# Altium project Apogee Detection.PrjPCB (part 1 of 2)
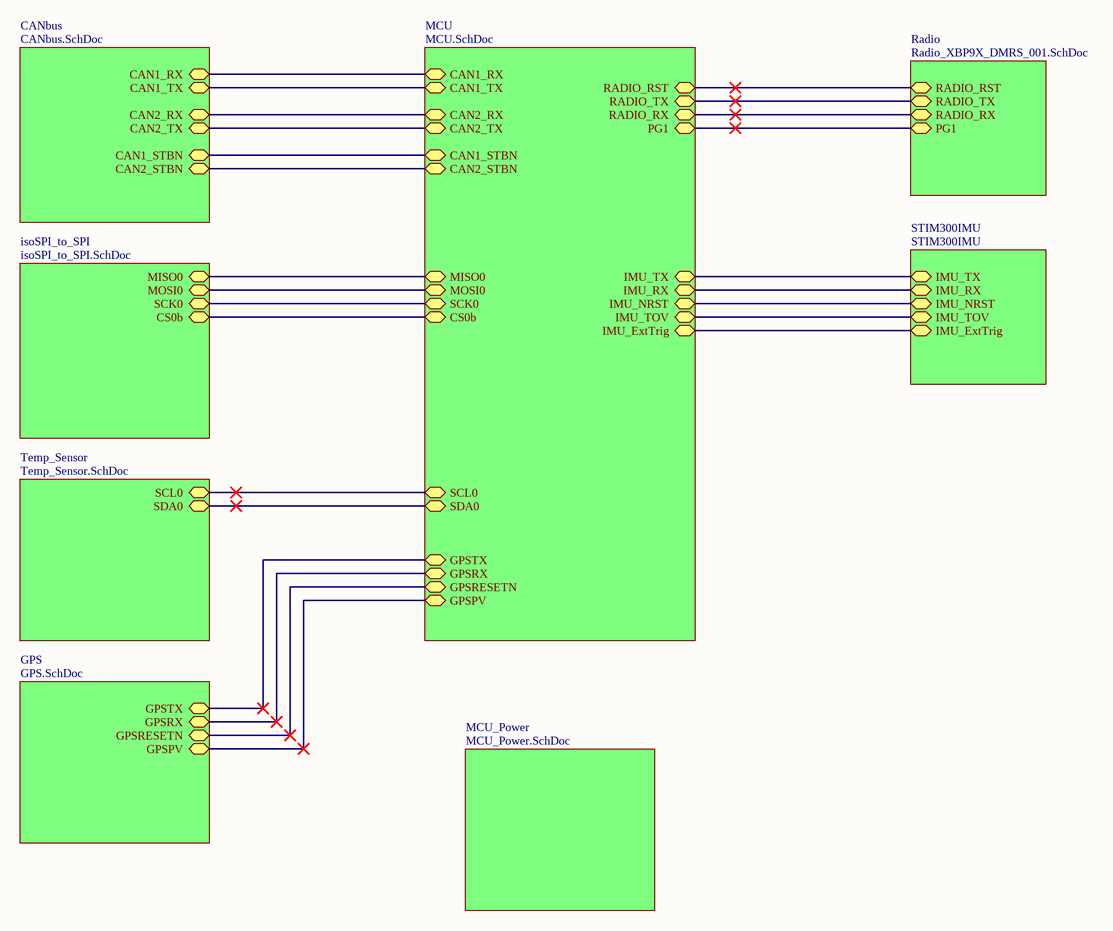
[diagram p0: Flight_Computer.SchDoc]
9 sheets, 125 parts. Net scope: hierarchical (ports join the sheet entries above them; power ports are global).
Board file: 4500-WB_AV_MainPCB.PcbDoc
Sheets:
  Flight_Computer.SchDoc
    MCU = MCU.SchDoc
    CANbus = CANbus.SchDoc
    isoSPI_to_SPI = isoSPI_to_SPI.SchDoc
    Temp_Sensor = Temp_Sensor.SchDoc
    Radio = Radio_XBP9X_DMRS_001.SchDoc
    STIM300IMU = STIM300IMU.SchDoc
    MCU_Power = MCU_Power.SchDoc
    GPS = GPS.SchDoc

## Sheet Flight_Computer.SchDoc
size Letter

### Sub-sheets
CANbus = CANbus.SchDoc: CAN1_RX (bidir), CAN1_TX (bidir), CAN2_RX (bidir), CAN2_TX (bidir), CAN1_STBN (bidir), CAN2_STBN (bidir)
GPS = GPS.SchDoc: GPSTX (bidir), GPSRX (bidir), GPSRESETN (bidir), GPSPV (bidir)
isoSPI_to_SPI = isoSPI_to_SPI.SchDoc: MISO0 (bidir), MOSI0 (bidir), SCK0 (bidir), CS0b (bidir)
MCU = MCU.SchDoc: CAN1_RX (bidir), CAN1_TX (bidir), CAN2_RX (bidir), CAN2_TX (bidir), MISO0 (bidir), MOSI0 (bidir), SCK0 (bidir), CS0b (bidir), SCL0 (bidir), SDA0 (bidir), CAN1_STBN (bidir), CAN2_STBN (bidir), RADIO_TX (bidir), RADIO_RX (bidir), IMU_TX (bidir), IMU_RX (bidir), IMU_NRST (bidir), IMU_TOV (bidir), IMU_ExtTrig (bidir), GPSTX (bidir), GPSRX (bidir), GPSRESETN (bidir), GPSPV (bidir), PG1 (bidir), RADIO_RST (bidir)
MCU_Power = MCU_Power.SchDoc: no entries
Radio = Radio_XBP9X_DMRS_001.SchDoc: RADIO_RX (bidir), RADIO_TX (bidir), PG1 (bidir), RADIO_RST (bidir)
STIM300IMU = STIM300IMU: IMU_TX (bidir), IMU_RX (bidir), IMU_NRST (bidir), IMU_TOV (bidir), IMU_ExtTrig (bidir)
Temp_Sensor = Temp_Sensor.SchDoc: SCL0 (bidir), SDA0 (bidir)

### Nets
CAN1_RX: sheet MCU/CAN1_RX, sheet CANbus/CAN1_RX
CAN1_STBN: sheet MCU/CAN1_STBN, sheet CANbus/CAN1_STBN
CAN1_TX: sheet MCU/CAN1_TX, sheet CANbus/CAN1_TX
CAN2_RX: sheet MCU/CAN2_RX, sheet CANbus/CAN2_RX
CAN2_STBN: sheet MCU/CAN2_STBN, sheet CANbus/CAN2_STBN
CAN2_TX: sheet MCU/CAN2_TX, sheet CANbus/CAN2_TX
CS0b: sheet MCU/CS0b, sheet isoSPI_to_SPI/CS0b
GPSPV: sheet MCU/GPSPV, sheet GPS/GPSPV
GPSRESETN: sheet MCU/GPSRESETN, sheet GPS/GPSRESETN
GPSRX: sheet MCU/GPSRX, sheet GPS/GPSRX
GPSTX: sheet MCU/GPSTX, sheet GPS/GPSTX
IMU_ExtTrig: sheet MCU/IMU_ExtTrig, sheet STIM300IMU/IMU_ExtTrig
IMU_NRST: sheet MCU/IMU_NRST, sheet STIM300IMU/IMU_NRST
IMU_RX: sheet MCU/IMU_RX, sheet STIM300IMU/IMU_RX
IMU_TOV: sheet MCU/IMU_TOV, sheet STIM300IMU/IMU_TOV
IMU_TX: sheet MCU/IMU_TX, sheet STIM300IMU/IMU_TX
MISO0: sheet MCU/MISO0, sheet isoSPI_to_SPI/MISO0
MOSI0: sheet MCU/MOSI0, sheet isoSPI_to_SPI/MOSI0
PG1: sheet MCU/PG1, sheet Radio/PG1
RADIO_RST: sheet MCU/RADIO_RST, sheet Radio/RADIO_RST
RADIO_RX: sheet MCU/RADIO_RX, sheet Radio/RADIO_RX
RADIO_TX: sheet MCU/RADIO_TX, sheet Radio/RADIO_TX
SCK0: sheet MCU/SCK0, sheet isoSPI_to_SPI/SCK0
SCL0: sheet MCU/SCL0, sheet Temp_Sensor/SCL0
SDA0: sheet MCU/SDA0, sheet Temp_Sensor/SDA0

## Sheet MCU.SchDoc
size A3
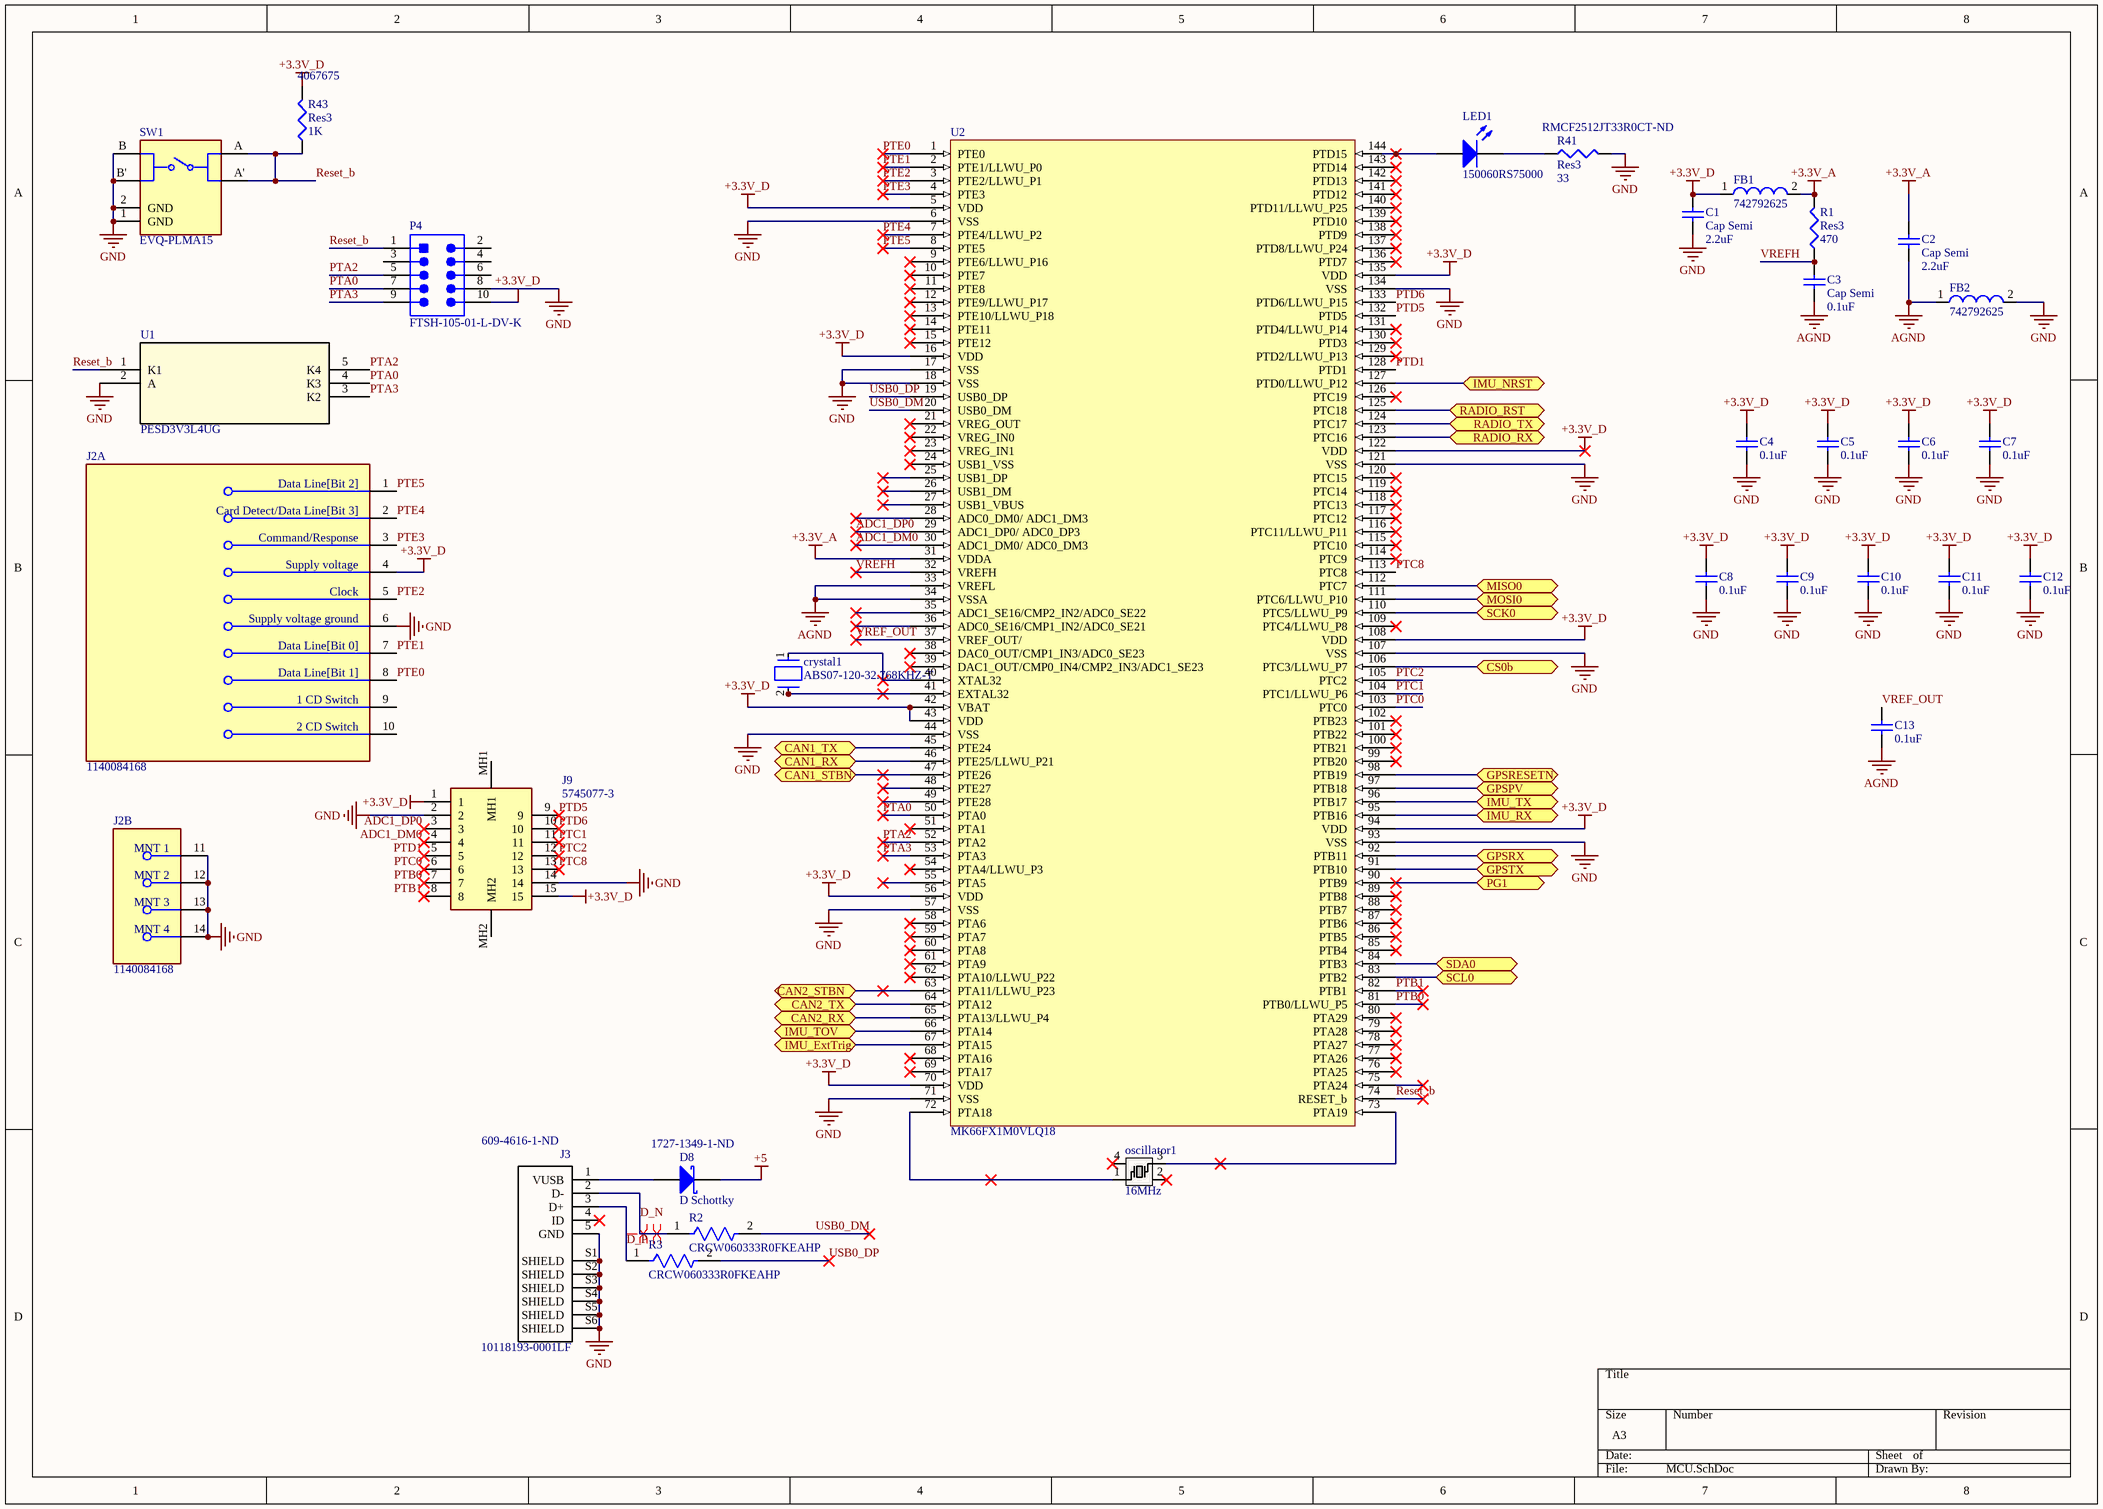
[diagram p1: MCU.SchDoc]

### Parts
C1  Cap Semi  value 2.2uF  [C1206]
C2  Cap Semi  value 2.2uF  [C1206]
C3  Cap Semi  value 0.1uF  [C1206]
C4  0.1uF  [J1-0603]
C5  0.1uF  [J1-0603]
C6  0.1uF  [J1-0603]
C7  0.1uF  [J1-0603]
C8  0.1uF  [J1-0603]
C9  0.1uF  [J1-0603]
C10  0.1uF  [J1-0603]
C11  0.1uF  [J1-0603]
C12  0.1uF  [J1-0603]
C13  0.1uF  [J1-0603]
crystal1  ABS07-120-32.768KHZ-T  [FP-ABS07-120-MFG]
D8  D Schottky  Supplier Part Number 1: 1727-1349-1-ND  [DIO_PMEG6030EVPX]
FB1  742792625  [SMD-0603]
FB2  742792625  [SMD-0603]
J2  1140084168  [FP-1140084168-0]  (parts A,B of 2)
J3  10118193-0001LF  Supplier Part Number 1: 609-4616-1-ND  [FCI_10118193-0001LF_10118193-0001LF(Primary)]
J9  5745077-3  [2301840-1]
LED1  150060RS75000  [0603_A]
oscillator1  value 16MHz  [ECS-160-8-30B-CKM]  (hidden comment: SMD_oscillator)
P4  FTSH-105-01-L-DV-K  [SMTC-FTSH-105-01-L-DV-K_V]
R1  Res3  value 470  [J1-0603]
R2  CRCW060333R0FKEAHP  [FP-CRCW0603-HPe3-IPC_B]
R3  CRCW060333R0FKEAHP  [FP-CRCW0603-HPe3-IPC_B]
R41  Res3  value 33  Supplier Part Number 2: RMCF2512JT33R0CT-ND  [J1-0603]
R43  Res3  value 1K  Supplier Part Number 1: 4067675  [J1-0603]
SW1  EVQ-PLMA15  [FP-EVQ-PLMA15-MFG]
U1  PESD3V3L4UG  [SOT353_NXP]
U2  MK66FX1M0VLQ18  [98ASS23177W]

### Ports
CAN1_RX (bidir), CAN1_STBN (bidir), CAN1_TX (bidir), CAN2_RX (bidir), CAN2_STBN (bidir), CAN2_TX (bidir), CS0b (bidir), GPSPV (bidir), GPSRESETN (bidir), GPSRX (bidir), GPSTX (bidir), IMU_ExtTrig (bidir), IMU_NRST (bidir), IMU_RX (bidir), IMU_TOV (bidir), IMU_TX (bidir), MISO0 (bidir), MOSI0 (bidir), PG1 (bidir), RADIO_RST (bidir), RADIO_RX (bidir), RADIO_TX (bidir), SCK0 (bidir), SCL0 (bidir), SDA0 (bidir)

### Nets
+3.3V_A: C2.2 FB1.2 R1.2 U2.31(VDDA)
+3.3V_D: C1.2 C4.2 C5.2 C6.2 C7.2 C8.2 C9.2 C10.2 C11.2 C12.2 FB1.1 J2.4(Supply_voltage) J9.1 J9.15 P4.10 R43.2 U2.5(VDD) U2.16(VDD) U2.42(VBAT) U2.43(VDD) U2.56(VDD) U2.70(VDD) U2.94(VDD) U2.108(VDD) U2.122(VDD) U2.135(VDD)
+5: D8.2(K)
AGND: C2.1 C3.1 C13.1 FB2.1 U2.33(VREFL) U2.34(VSSA)
GND: C1.1 C4.1 C5.1 C6.1 C7.1 C8.1 C9.1 C10.1 C11.1 C12.1 FB2.2 J2.6(Supply_voltage_ground) J2.11(MNT_1) J2.12(MNT_2) J2.13(MNT_3) J2.14(MNT_4) J3.5(GND) J3.S1(SHIELD) J3.S2(SHIELD) J3.S3(SHIELD) J3.S4(SHIELD) J3.S5(SHIELD) J3.S6(SHIELD) J9.2 J9.14 P4.8 R41.2 SW1.1(GND) SW1.2(GND) SW1.B SW1.B' U1.2(A) U2.6(VSS) U2.17(VSS) U2.18(VSS) U2.44(VSS) U2.57(VSS) U2.71(VSS) U2.93(VSS) U2.107(VSS) U2.121(VSS) U2.134(VSS)
ADC1_DM0: J9.4 U2.30(ADC1_DM0/_ADC0_DM3)
ADC1_DP0: J9.3 U2.29(ADC1_DP0/_ADC0_DP3)
CAN1_RX: U2.46(PTE25/LLWU_P21) ; port CAN1_RX
CAN1_STBN: U2.47(PTE26) ; port CAN1_STBN
CAN1_TX: U2.45(PTE24) ; port CAN1_TX
CAN2_RX: U2.65(PTA13/LLWU_P4) ; port CAN2_RX
CAN2_STBN: U2.63(PTA11/LLWU_P23) ; port CAN2_STBN
CAN2_TX: U2.64(PTA12) ; port CAN2_TX
CS0b: U2.106(PTC3/LLWU_P7) ; port CS0b
D_N: J3.2(D-) R2.1
D_P: J3.3(D+) R3.1
GPSPV: U2.97(PTB18) ; port GPSPV
GPSRESETN: U2.98(PTB19) ; port GPSRESETN
GPSRX: U2.92(PTB11) ; port GPSRX
GPSTX: U2.91(PTB10) ; port GPSTX
IMU_ExtTrig: U2.67(PTA15) ; port IMU_ExtTrig
IMU_NRST: U2.127(PTD0/LLWU_P12) ; port IMU_NRST
IMU_RX: U2.95(PTB16) ; port IMU_RX
IMU_TOV: U2.66(PTA14) ; port IMU_TOV
IMU_TX: U2.96(PTB17) ; port IMU_TX
MISO0: U2.112(PTC7) ; port MISO0
MOSI0: U2.111(PTC6/LLWU_P10) ; port MOSI0
PG1: U2.90(PTB9) ; port PG1
PTA0: P4.7 U1.4(K3) U2.50(PTA0)
PTA2: P4.5 U1.5(K4) U2.52(PTA2)
PTA3: P4.9 U1.3(K2) U2.53(PTA3)
PTB0: J9.7 U2.81(PTB0/LLWU_P5)
PTB1: J9.8 U2.82(PTB1)
PTC0: J9.6 U2.103(PTC0)
PTC1: J9.11 U2.104(PTC1/LLWU_P6)
PTC2: J9.12 U2.105(PTC2)
PTC8: J9.13 U2.113(PTC8)
PTD1: J9.5 U2.128(PTD1)
PTD5: J9.9 U2.132(PTD5)
PTD6: J9.10 U2.133(PTD6/LLWU_P15)
PTE0: J2.8(Data_Line[Bit_1]) U2.1(PTE0)
PTE1: J2.7(Data_Line[Bit_0]) U2.2(PTE1/LLWU_P0)
PTE2: J2.5(Clock) U2.3(PTE2/LLWU_P1)
PTE3: J2.3(Command/Response) U2.4(PTE3)
PTE4: J2.2(Card_Detect/Data_Line[Bit_3]) U2.7(PTE4/LLWU_P2)
PTE5: J2.1(Data_Line[Bit_2]) U2.8(PTE5)
RADIO_RST: U2.125(PTC18) ; port RADIO_RST
RADIO_RX: U2.123(PTC16) ; port RADIO_RX
RADIO_TX: U2.124(PTC17) ; port RADIO_TX
Reset_b: P4.1 R43.1 SW1.A SW1.A' U1.1(K1) U2.74(RESET_b)
SCK0: U2.110(PTC5/LLWU_P9) ; port SCK0
SCL0: U2.83(PTB2) ; port SCL0
SDA0: U2.84(PTB3) ; port SDA0
USB0_DM: R2.2 U2.20(USB0_DM)
USB0_DP: R3.2 U2.19(USB0_DP)
VREF_OUT: C13.2 U2.37(VREF_OUT/)
VREFH: C3.2 R1.1 U2.32(VREFH)
Netcrystal1_1: crystal1.1 U2.40(XTAL32)
Netcrystal1_2: crystal1.2 U2.41(EXTAL32)
NetD8_1: D8.1(A) J3.1(VUSB)
NetLED1_1: LED1.1(K) R41.1
NetLED1_2: LED1.2(A) U2.144(PTD15)
Netoscillator1_1: oscillator1.1 U2.72(PTA18)
Netoscillator1_3: oscillator1.3 U2.73(PTA19)

Not connected (* = marked no-connect by the designer): J2 9(1_CD_Switch) 10(2_CD_Switch); J3 4(ID)*; J9 MH1 MH2; oscillator1 2* 4*; P4 2 3 4 6; U2 9(PTE6/LLWU_P16)* 10(PTE7)* 11(PTE8)* 12(PTE9/LLWU_P17)* 13(PTE10/LLWU_P18)* 14(PTE11)* 15(PTE12)* 21(VREG_OUT)* 22(VREG_IN0)* 23(VREG_IN1)* 24(USB1_VSS)* 25(USB1_DP)* 26(USB1_DM)* 27(USB1_VBUS)* 28(ADC0_DM0/_ADC1_DM3)* 35(ADC1_SE16/CMP2_IN2/ADC0_SE22)* 36(ADC0_SE16/CMP1_IN2/ADC0_SE21)* 38(DAC0_OUT/CMP1_IN3/ADC0_SE23)* 39(DAC1_OUT/CMP0_IN4/CMP2_IN3/ADC1_SE23)* 48(PTE27)* 49(PTE28)* 51(PTA1)* 54(PTA4/LLWU_P3)* 55(PTA5)* 58(PTA6)* 59(PTA7)* 60(PTA8)* 61(PTA9)* 62(PTA10/LLWU_P22)* 68(PTA16)* 69(PTA17)* 75(PTA24)* 76(PTA25)* 77(PTA26)* 78(PTA27)* 79(PTA28)* 80(PTA29)* 85(PTB4)* 86(PTB5)* 87(PTB6)* 88(PTB7)* 89(PTB8)* 99(PTB20)* 100(PTB21)* 101(PTB22)* 102(PTB23)* 109(PTC4/LLWU_P8)* 114(PTC9)* 115(PTC10)* 116(PTC11/LLWU_P11)* 117(PTC12)* 118(PTC13)* 119(PTC14)* 120(PTC15)* 126(PTC19)* 129(PTD2/LLWU_P13)* 130(PTD3)* 131(PTD4/LLWU_P14)* 136(PTD7)* 137(PTD8/LLWU_P24)* 138(PTD9)* 139(PTD10)* 140(PTD11/LLWU_P25)* 141(PTD12)* 142(PTD13)* 143(PTD14)*

### Layout directives
differential pair: D_N, D_P

### Library data of the parts
C1 C2 = Cap Semi: Capacitor (Semiconductor SIM Model); SPN: 311-3513-1-ND; Published: 8-Jun-2000; LatestRevisionDate: 29-May-2009; LatestRevisionNote: IPC-7351 Footprint Added.; PackageReference: C1206; Publisher: Altium Limited; PackageDescription: Chip Capacitor
C3 = Cap Semi: Capacitor (Semiconductor SIM Model); SPN: 1276-1017-1-ND; Published: 8-Jun-2000; LatestRevisionDate: 29-May-2009; LatestRevisionNote: IPC-7351 Footprint Added.; PackageReference: C1206; Publisher: Altium Limited; PackageDescription: Chip Capacitor
C4-C13 = CAP-0402: CAP CER 0.1UF 25V X7R 0603; Manufacturer: Kyocera AVX; Manufacturer Part Number: 06033C104JAT2A; Dielectric Material: Ceramic; Capacitance: 100nF; Tolerance: 5%; Supplier 1: Digi-Key; Supplier Part Number 1: 478-3713-1-ND; RoHS: Yes; Category: Ceramic Capacitors; Stock 1: 348868; Pricing 1: 1=0.33000, 10=0.23100, 50=0.16180, 100=0.13870, 500=0.10400, 1000=0.08782 (USD); Mount: Surface Mount,PCB,Through Hole; Case/Package: 0603; Number of Pins: 2; Case Code (Metric): 1608; Case Code (Imperial): 0603; Contact Plating: Tin,Matte; Min Operating Temperature: -55°C; Max Operating Temperature: 125°C; Voltage Rating: 25V; Packaging: Tape and Reel; Package Quantity: 1; Dielectric: X7R; Termination: SMD/SMT; Voltage Rating (DC): 25V; Voltage: 25V; Length: 1.6mm; Height: 0.9mm; Width: 0.032inch; Thickness: 0.035inch; Depth: 0.81mm; Lead Pitch: 5.08mm; Radiation Hardening: No; REACH SVHC: No SVHC; Lead Free: Lead Free; ComponentLink1URL: https://datasheet.ciiva.com/208/cx7r-208464.pdf?src-supplier=Digi-Key; ComponentLink1Description: https://datasheet.ciiva.com/208/cx7r-208464.pdf?src-supplier=Digi-Key; ComponentLink2URL: https://datasheet.ciiva.com/208/cx7r-208465.pdf?src-supplier=Digi-Key; ComponentLink2Description: https://datasheet.ciiva.com/208/cx7r-208465.pdf?src-supplier=Digi-Key; ComponentLink3URL: https://datasheet.ciiva.com/1124/1679506-1124547.pdf?src-supplier=Element14; ComponentLink3Description: https://datasheet.ciiva.com/1124/1679506-1124547.pdf?src-supplier=Element14; ComponentLink4URL: https://datasheet.ciiva.com/1124/1679506-1124548.pdf?src-supplier=Element14; ComponentLink4Description: https://datasheet.ciiva.com/1124/1679506-1124548.pdf?src-supplier=Element14; ComponentLink5URL: https://datasheet.ciiva.com/5423/cx7r-218113-5423653.pdf?src-supplier=Mouser; ComponentLink5Description: https://datasheet.ciiva.com/5423/cx7r-218113-5423653.pdf?src-supplier=Mouser; ComponentLink6URL: https://datasheet.ciiva.com/7855/1679506-7855045.pdf?src-supplier=Element14; ComponentLink6Description: https://datasheet.ciiva.com/7855/1679506-7855045.pdf?src-supplier=Element14; ComponentLink7URL: https://datasheet.ciiva.com/15165/getdatasheetpartid-33578-15165094.pdf?src-supplier=Verical; ComponentLink7Description: https://datasheet.ciiva.com/15165/getdatasheetpartid-33578-15165094.pdf?src-supplier=Verical; ComponentLink8URL: https://datasheet.ciiva.com/2987/cx7r-2987753.pdf?src-supplier=Avnet; ComponentLink8Description: https://datasheet.ciiva.com/2987/cx7r-2987753.pdf?src-supplier=Avnet; ComponentLink9URL: https://datasheet.ciiva.com/14595/70001075-14595082.pdf?src-supplier=Allied+Electronics; ComponentLink9Description: https://datasheet.ciiva.com/14595/70001075-14595082.pdf?src-supplier=Allied+Electronics; ComponentLink10URL: https://datasheet.ciiva.com/14590/70001075-14590332.pdf?src-supplier=Allied+Electronics; ComponentLink10Description: https://datasheet.ciiva.com/14590/70001075-14590332.pdf?src-supplier=Allied+Electronics; ComponentLink11URL: https://datasheet.ciiva.com/208/cx7r-208463.pdf?src-supplier=Digi-Key; ComponentLink11Description: https://datasheet.ciiva.com/208/cx7r-208463.pdf?src-supplier=Digi-Key
crystal1 = CMP-2000-07587-2: CRYSTAL 32.7680KHZ 6PF SMD; Frequency Tolerance: 20ppm; Series Resistance: 60kR; ESR (Equivalent Series Resistance): 55kR; Depth: 1.5mm; Width: 0.061inch; Number of Pins: 2; Max Operating Temperature: 85°C; Length: 3.2mm; Case/Package: SMD/SMT; Series: ABS07; Lead Free: Lead Free; Min Operating Temperature: -40°C; Load Capacitance: 6pF; Packaging: Tape and Reel; Height: 0.035inch; Radiation Hardening: No; Tolerance: 20ppm; Operating Frequency: 32.768 kHz; Termination: SMD/SMT; REACH SVHC: No SVHC; RoHS Compliant: Yes; Frequency: 32.768kHz; Package Quantity: 3000; Mount: Surface Mount
D8 = D Schottky: Rectifier Diode, Single, 60 V, 3 A, 475 Mv, 70 A, 175 C Rohs Compliant: Yes; Manufacturer: Nexperia USA; Manufacturer Part Number: PMEG6030EVPX; Average Rectified Current: 3A; Reverse Recovery Time: 20ns; Max Reverse Voltage (DC): 60V; Published: 8-Jun-2000; LatestRevisionDate: 17-Jul-2002; LatestRevisionNote: Re-released for DXP Platform.; PackageReference: SMB; Publisher: Altium Limited; PackageDescription: DO-214-AA/SMB; 2 C-Bend Leads; Body 5.3 x 3.6 mm, inc. leads (LxW); Code_JEDEC: DO-214-AA; Supplier 1: Digi-Key; RoHS: No; Category: Rectifier Diodes; Stock 1: 480077; Pricing 1: 1=0.47000, 10=0.38100, 100=0.21860, 500=0.20242, 1000=0.13765 (USD); Mount: Surface Mount; Packaging: Cut Tape; ComponentLink1URL: https://assets.nexperia.com/documents/data-sheet/PMEG6030EVP.pdf?src-supplier=Digi-Key; ComponentLink1Description: https://assets.nexperia.com/documents/data-sheet/PMEG6030EVP.pdf?src-supplier=Digi-Key
FB1 FB2 = CMP-0220-00174-1: SMD EMI Suppression Ferrite Bead WE-CBF, Z = 120 Ohm; Impedance: 120 Ohm; ComponentLink1Description: Manufacturer Link; ComponentLink1URL: http://www.we-online.com; DatasheetVersion: ver 1, Aug-2009; ComponentLink2URL: http://www.we-online.de/katalog/media/pdf/742792625.pdf; PackageDescription: Chip Inductor, 2-Leads, Body 1.6 x 0.8 mm; PackageReference: SMD-0603; ComponentLink2Description: Datasheet; PackageVersion: 2009
J2 = CMP-02360-000003-1: CONN MICRO SD CARD PUSH-PULL R/A; Gender: Receptacle; Number of Contacts: 8; Connector Type: Connector; Pitch: 1.1mm; Lead Free: Lead Free; Housing Material: Polymer; Radiation Hardening: No; Mount: Surface Mount; Depth: 11.45mm; Number of Rows: 1; Height: 1.55mm; Contact Plating: Gold; Package Quantity: 7500; Packaging: Tape and Reel; Termination: SMD/SMT; Length: 15.6mm; Orientation: Right Angle; Flammability Rating: UL94 V-0; Contact Material: Copper Alloy
J3 = 10118193-0001LF: CONN USB MICRO B RECPT SMT R/A; MF: Amphenol FCI; Gender: Female; Connector Type: USB,Receptacle; Number of Contacts: 5; Number of Ports: 1; Current Rating: 1.8A; Insulation Resistance: 1GR; Max Voltage Rating (AC): 100V; Pitch: 0.65mm; SnapEDA_Link: https://www.snapeda.com/parts/10118193-0001LF/Amphenol%20FCI/view-part/?ref=snap; Digi-Key_Purchase_URL: https://www.digikey.ca/product-detail/en/amphenol-fci/10118193-0001LF/609-4616-1-ND/2785380?utm_source=snapeda&utm_medium=aggregator&utm_campaign=symbol; Package: None; MP: 10118193-0001LF; Digi-Key_Part_Number: 609-4616-1-ND; Value: *; Supplier 1: Digi-Key; Manufacturer: Amphenol FCI; Manufacturer Part Number: 10118193-0001LF; RoHS: Yes; Category: USB Connectors; Stock 1: 48313; Pricing 1: 1=0.45000, 10=0.43000, 25=0.36840, 50=0.31320, 100=0.30090, 250=0.27016, 500=0.25788 (USD); Mount: Surface Mount,Horizontal; Contact Plating: Gold; Contact Material: Copper Alloy; Color: Black; Number of Terminals: 5; Housing Material: Polymer; Min Operating Temperature: -55°C; Max Operating Temperature: 85°C; Termination: Solder; Packaging: Tape and Reel; Orientation: Right Angle; Package Quantity: 1200; Voltage Rating: 100V; Features: Shielded; Length: 7.86mm; Depth: 5.67mm; Radiation Hardening: No; Flammability Rating: UL94 V-0; ComponentLink1URL: https://datasheet.ciiva.com/851/10118193-851106.pdf?src-supplier=Digi-Key; ComponentLink1Description: https://datasheet.ciiva.com/851/10118193-851106.pdf?src-supplier=Digi-Key; ComponentLink2URL: https://datasheet.ciiva.com/4598/10118193ac-197151-4598799.pdf?src-supplier=Mouser; ComponentLink2Description: https://datasheet.ciiva.com/4598/10118193ac-197151-4598799.pdf?src-supplier=Mouser; ComponentLink3URL: https://datasheet.ciiva.com/26853/getdatasheetpartid-418618-26853893.pdf?src-supplier=Verical; ComponentLink3Description: https://datasheet.ciiva.com/26853/getdatasheetpartid-418618-26853893.pdf?src-supplier=Verical; ComponentLink4URL: https://datasheet.ciiva.com/14802/10118193-0001lf-webpage-14802386.pdf?src-supplier=Arrow+Electronics; ComponentLink4Description: https://datasheet.ciiva.com/14802/10118193-0001lf-webpage-14802386.pdf?src-supplier=Arrow+Electronics; ComponentLink5URL: https://datasheet.ciiva.com/851/10118193-851108.pdf?src-supplier=Digi-Key; ComponentLink5Description: https://datasheet.ciiva.com/851/10118193-851108.pdf?src-supplier=Digi-Key; ComponentLink6URL: https://datasheet.ciiva.com/851/10118193-851107.pdf?src-supplier=Digi-Key; ComponentLink6Description: https://datasheet.ciiva.com/851/10118193-851107.pdf?src-supplier=Digi-Key; ComponentLink7URL: https://datasheet.ciiva.com/14618/70236827-14618887.pdf?src-supplier=Allied+Electronics; ComponentLink7Description: https://datasheet.ciiva.com/14618/70236827-14618887.pdf?src-supplier=Allied+Electronics
J9 = 5745077-3: Connector; Manufacturer_Name: TE Connectivity; Datasheet Link: https://www.te.com/commerce/DocumentDelivery/DDEController?Action=srchrtrv&DocNm=5745077&DocType=Customer+Drawing&DocLang=English; Height: 12.55mm; Manufacturer_Part_Number: 5745077-3
LED1 = CMP-1426-00001-1: SMD mono-color Chip LED, WL-SMCW, Red; Manufacturer: Wuerth Elektronik; Color: Red; PackageReference: 0603_A; ComponentLink2URL: http://katalog.we-online.com/led/datasheet/150060RS75000.pdf; ComponentLink1URL: http://www.we-online.com; ComponentLink1Description: Manufacturer URL; ComponentLink2Description: Datasheet; PartNumber: 150060RS75000
oscillator1 = ECS-160-8-30B-CKM: SPN: XC1839CT-ND
P4 = CMP-2000-05353-1: Male Header, Pitch 1.27 mm, 2 x 5 Position, Height 6.25 mm; Manufacturer: Samtec; Pitch: 0.050"(1.27mm); Other Names: Q3937619; Number of Positions: 10; Mating Products: SFMC-105-L2-S-D-TR-ND / -CONN.05"SURFACE10POSSMT / FLE-105-01-G-DV-TR-ND / -CONNSKT1.27MM10POSDUALSMD / FLE-105-01-G-DV-A-P-ND / -CONNSKT1.27MM10POSDUALSMD / FLE-105-01-G-DV-A-ND / -CONNSKT1.27MM10POSDUALSMD / CLP-105-02-G-D-P-TR-ND / -CONNRCPT10POSDUAL.05"SMD / SAM1155-05-ND / -CONNRCPT10POSDUAL.05"SMD / SAM1154-05-ND / -CONNRCPT10POSDUAL.05"SMD / SAM1153-05-ND / -CONNRCPT10POSDUAL.05"SMD / SAM1226-05-ND / -CONNRCPT.05"10POSDUALSMD; Number of Positions Loaded: All; Connector Type: Header,Unshrouded; Product Training Modules: Board-to-BoardConnectors; Datasheet Version: Rev. ET, 10/1995; Number of Rows: 2; Standard Package: 1; Package Description: Male Header, Pitch 1.27 mm, 2 x 5 Position, Height 5.97 mm, Tail Length 4.32 mm; Contact Finish Thickness: 10µin(0.25µm); Series: FTSH; Termination: Solder; Contact Type: MalePin; Color: Black; Package Reference: FTSH-105-01-L-DV-K; Family: RectangularConnectors-Headers,MalePins; Package URL: http://suddendocs.samtec.com/prints/ftsh-1xx-xx-xxx-dv-xxx-footprint.pdf; Packaging: Tube; Mounting Type: SurfaceMount; Category: Connectors,Interconnects; Datasheet URL: http://suddendocs.samtec.com/prints/ftsh-1xx-xx-xxx-dv-xxx-mkt.pdf; Row Spacing: 0.050"(1.27mm); Manufacturer URL: http://www.samtec.com/; Contact Mating Length: 0.120"(3.05mm); Contact Finish: Gold
R1 = Res3: Resistor; SPN: RHM470ADCT-ND; Published: 8-Jun-2000; LatestRevisionDate: 29-May-2009; LatestRevisionNote: IPC-7351 Footprint Added.; PackageReference: J1-0603; Publisher: Altium Limited; PackageDescription: Chip Resistor
R2 R3 = CMP-02407-002371-1: RES Thick Film, 33Ω, 1%, 0.33W, 100ppm/°C, 0603; Power Rating: 250mW; Voltage Rating: 75V; Resistance: 33R; Max Operating Temperature: 155°C; Tolerance: 1%; Depth: 0.85mm; Radiation Hardening: No; Contact Plating: Tin; Length: 1.6mm; Features: Automotive AEC-Q200; Case/Package: 0603; Lead Free: Lead Free; Width: 0.033inch; Voltage Rating (DC): 75V; Mount: Surface Mount; Termination: SMD/SMT; Packaging: Tape and Reel; Package Quantity: 10; Composition: Thick Film; Min Operating Temperature: -55°C; Case Code (Metric): 1608; Height: 0.45mm; Military Standard: Not; Max Power Dissipation: 250mW; Number of Terminations: 2; Weight: 7.1E-05oz; Temperature Coefficient: 100ppm/°C; Case Code (Imperial): 0603
R41 = Res3: RES SMD 33 OHM 5% 1W 2512; Manufacturer: Vishay; Manufacturer Part Number: CRCW060333R0FKEA; SPN: 541-2782-1-ND; Resistance: 33R; Tolerance: 1%; Temperature Coefficient: 100ppm/°C; Power Rating: 100mW; Voltage Rating: 75V; Published: 8-Jun-2000; LatestRevisionDate: 29-May-2009; LatestRevisionNote: IPC-7351 Footprint Added.; PackageReference: J1-0603; Publisher: Altium Limited; PackageDescription: Chip Resistor; Supplier 1: Digi-Key; Supplier Part Number 1: 541-33.0HCT-ND; RoHS: Yes; Category: Chip SMD Resistors; Stock 1: 59910; Pricing 1: 1=0.10000, 10=0.03300, 100=0.01340, 1000=0.00602, 2500=0.00522 (USD); Mount: Surface Mount; Case/Package: 0603; Weight: 7.1E-05oz; Case Code (Imperial): 0603; Case Code (Metric): 1608; Contact Plating: Tin; Min Operating Temperature: -55°C; Max Operating Temperature: 155°C; Composition: Thick Film; Packaging: Tape and Reel; Number of Terminations: 2; Max Power Dissipation: 100mW; Voltage Rating (DC): 75V; Package Quantity: 10; Military Standard: Not; Termination: SMD/SMT; Features: Automotive AEC-Q200; Length: 1.55mm; Height: 0.45mm; Width: 0.85mm; Depth: 0.85mm; Radiation Hardening: No; Lead Free: Lead Free; REACH SVHC: Unknown; ComponentLink1URL: https://datasheet.ciiva.com/11809/0900766b80d98afc-11809158.pdf?src-supplier=RSComponents; ComponentLink1Description: https://datasheet.ciiva.com/11809/0900766b80d98afc-11809158.pdf?src-supplier=RSComponents; ComponentLink2URL: https://datasheet.ciiva.com/7777/1697337-7777317.pdf?src-supplier=Element14; ComponentLink2Description: https://datasheet.ciiva.com/7777/1697337-7777317.pdf?src-supplier=Element14; ComponentLink3URL: https://datasheet.ciiva.com/7777/1720486-7777557.pdf?src-supplier=Element14; ComponentLink3Description: https://datasheet.ciiva.com/7777/1720486-7777557.pdf?src-supplier=Element14; ComponentLink4URL: https://datasheet.ciiva.com/16783/70201119-16783349.pdf?src-supplier=Allied+Electronics; ComponentLink4Description: https://datasheet.ciiva.com/16783/70201119-16783349.pdf?src-supplier=Allied+Electronics; ComponentLink5URL: https://datasheet.ciiva.com/7777/1720486-7777558.pdf?src-supplier=Element14; ComponentLink5Description: https://datasheet.ciiva.com/7777/1720486-7777558.pdf?src-supplier=Element14; ComponentLink6URL: https://datasheet.ciiva.com/16771/70201119-16771126.pdf?src-supplier=Allied+Electronics; ComponentLink6Description: https://datasheet.ciiva.com/16771/70201119-16771126.pdf?src-supplier=Allied+Electronics; ComponentLink7URL: https://datasheet.ciiva.com/2465/dcrcwe3-2465591.pdf?src-supplier=Digi-Key; ComponentLink7Description: https://datasheet.ciiva.com/2465/dcrcwe3-2465591.pdf?src-supplier=Digi-Key; ComponentLink8URL: https://datasheet.ciiva.com/2465/dcrcwe3-2465592.pdf?src-supplier=Digi-Key; ComponentLink8Description: https://datasheet.ciiva.com/2465/dcrcwe3-2465592.pdf?src-supplier=Digi-Key; ComponentLink9URL: https://datasheet.ciiva.com/2465/dcrcwe3-2465593.pdf?src-supplier=Digi-Key; ComponentLink9Description: https://datasheet.ciiva.com/2465/dcrcwe3-2465593.pdf?src-supplier=Digi-Key; ComponentLink10URL: https://datasheet.ciiva.com/16893/dcrcwe3-16893242.pdf?src-supplier=Avnet+Europe; ComponentLink10Description: https://datasheet.ciiva.com/16893/dcrcwe3-16893242.pdf?src-supplier=Avnet+Europe; Supplier 2: Digi-Key; Stock 2: 13779; Pricing 2: 1=0.26000, 10=0.22000, 100=0.08600, 1000=0.03600 (USD); Resistor Type: Thick Film; ComponentLink11URL: http://components.arrow.com/part/dataview/50590633S359032N1174?src-supplier=Arrow+Electronics; ComponentLink11Description: http://components.arrow.com/part/dataview/50590633S359032N1174?src-supplier=Arrow+Electronics; ComponentLink12URL: https://www.seielect.com/Catalog/SEI-RMCF_RMCP.pdf?src-supplier=Digi-Key; ComponentLink12Description: https://www.seielect.com/Catalog/SEI-RMCF_RMCP.pdf?src-supplier=Digi-Key; ComponentLink13URL: https://www.seielect.com/catalog/SEI-Packaging.pdf?src-supplier=Digi-Key; ComponentLink13Description: https://www.seielect.com/catalog/SEI-Packaging.pdf?src-supplier=Digi-Key; ComponentLink14URL: https://www.seielect.com/catalog/SEI-RMCF_RMCP.pdf?src-supplier=Avnet; ComponentLink14Description: https://www.seielect.com/catalog/SEI-RMCF_RMCP.pdf?src-supplier=Avnet; ComponentLink15URL: http://www.seielect.com/Catalog/SEI-RMCF_RMCP.pdf?src-supplier=Future+Electronics; ComponentLink15Description: http://www.seielect.com/Catalog/SEI-RMCF_RMCP.pdf?src-supplier=Future+Electronics
R43 = Res3: Resistor; Published: 8-Jun-2000; LatestRevisionDate: 29-May-2009; LatestRevisionNote: IPC-7351 Footprint Added.; PackageReference: J1-0603; Publisher: Altium Limited; PackageDescription: Chip Resistor; Supplier 1: Future Electronics
SW1 = CMP-05618-000006-1: SWITCH TACTILE SPST-NO 0.02A 15V; Manufacturer: Panasonic Electronic Components; Operating Force: 2.6N; Contact Resistance: 50mΩ; Contact Current Rating: 20mA; Electromechanical Life: 200000Cycles; Throw Configuration: SPST-NO; Automotive: No; Digikey Description: SWITCH TACTILE SPST-NO 0.02A 15V; Device Class L3: Tactile Switches; Device Class L2: Switches; Temperature Range Low: -20°C; ComponentLink2Description: Datasheet; RoHS: TRUE; Mount: Surface Mount; Package: 0; Height: 1.7mm; Octopart: https://octopart.com/evq-plma15-panasonic-39850235; Temperature Range High: +70°C; Device Class L1: Electromechanical; Category: Switch; Mouser Description: Tactile Switches FLAT ACT 2.6NF 4.6x3.4x1.5mm; Voltage Rating Dc: 15V; Manufacturer Part Number: EVQ-PLMA15; ComponentLink2URL: https://datasheet.ciiva.com/8164/atv0000ce2-8164994.pdf; Lead Free: Yes; Temperature: -20°C to +70°C
U1 = PESD3V3L4UG: No Description Available; Vendor: NXP; Built_By: EMA_UL_Team; SourceLibrary: NXP_2011-11-10; Manufacturer_Part_Number: PESD3V3L4UG; Copyright: Copyright (C) 2018 Accelerated Designs. All rights reserved; RefDes: RefDes; Type: DEV
U2 = Component_1

## Sheet CANbus.SchDoc
size A4
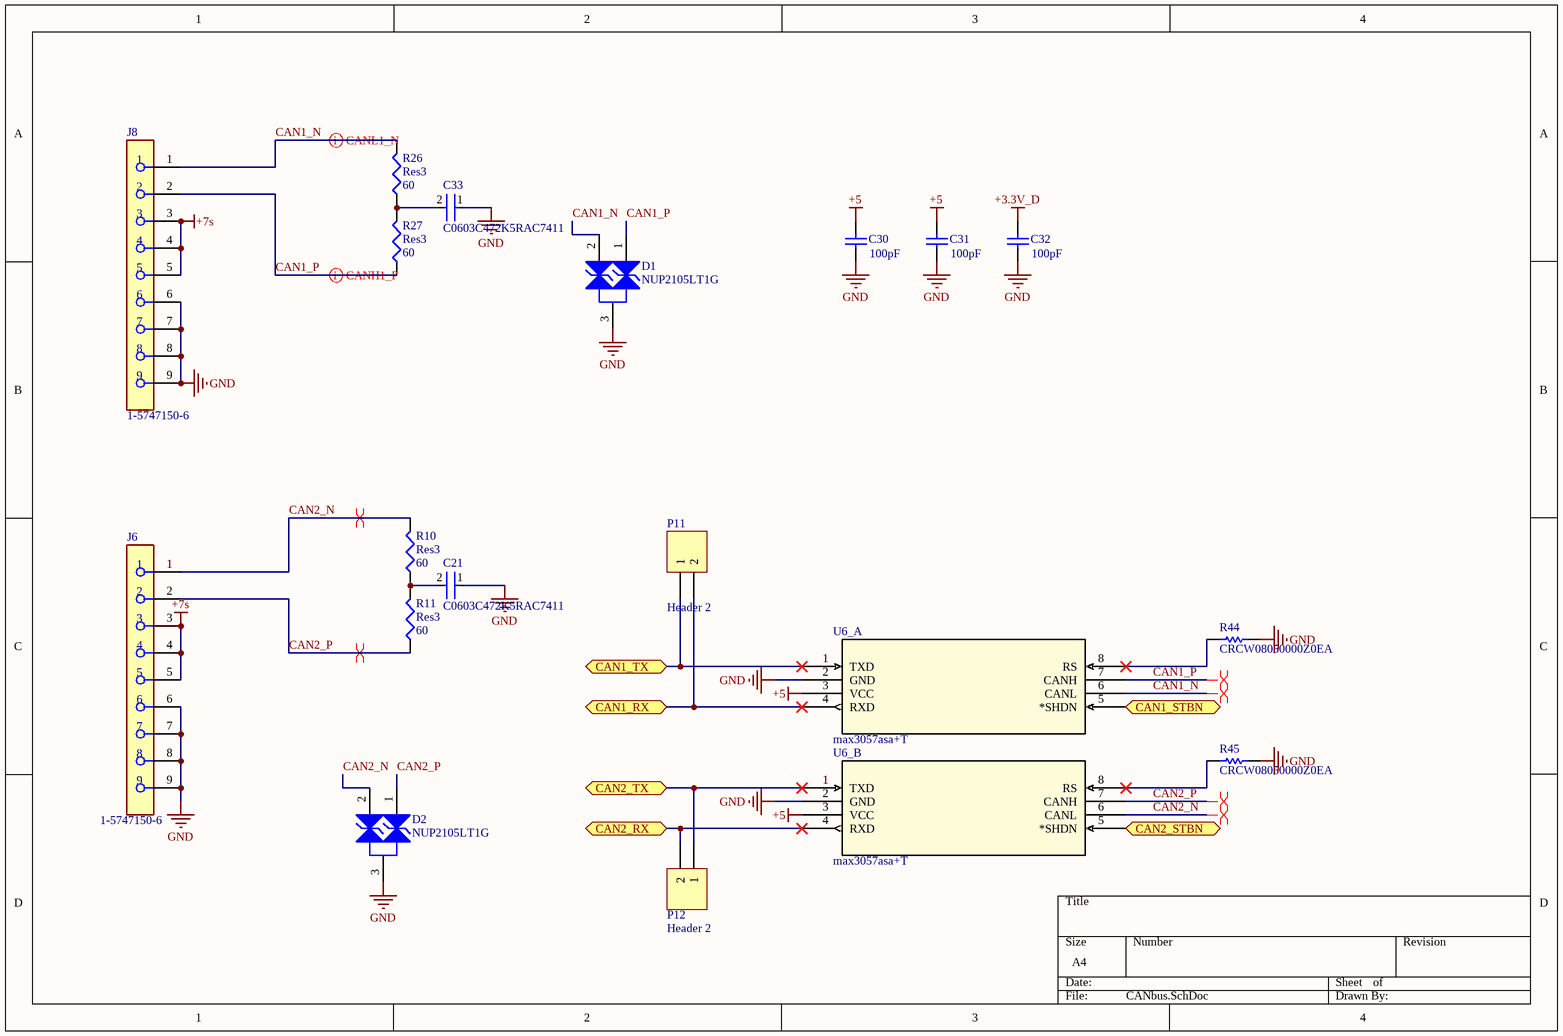
[diagram p2: CANbus.SchDoc]

### Parts
C21  C0603C472K5RAC7411  [FP-C0603C-CF-MFG]
C30  value 100pF  [CAPC1608X90X35NL10T15]  (hidden comment: GRM1885C1H101JA01D)
C31  value 100pF  [CAPC1608X90X35NL10T15]  (hidden comment: GRM1885C1H101JA01D)
C32  value 100pF  [CAPC1608X90X35NL10T15]  (hidden comment: GRM1885C1H101JA01D)
C33  C0603C472K5RAC7411  [FP-C0603C-CF-MFG]
D1  NUP2105LT1G  [ONSC-SOT-23-3-318-08_V]
D2  NUP2105LT1G  [ONSC-SOT-23-3-318-08_V]
J6  1-5747150-6  [FP-1-5747150-6-MFG]
J8  1-5747150-6  [FP-1-5747150-6-MFG]
P11  Header 2  [HDR1X2]
P12  Header 2  [HDR1X2]
R10  Res3  value 60  [J1-0603]
R11  Res3  value 60  [J1-0603]
R26  Res3  value 60  [J1-0603]
R27  Res3  value 60  [J1-0603]
R44  CRCW08050000Z0EA  [RESC2013X50X30LL20T20]
R45  CRCW08050000Z0EA  [RESC2013X50X30LL20T20]
U6_A  max3057asa+T  [21-0041B_8_MXM]
U6_B  max3057asa+T  [21-0041B_8_MXM]

### Ports
CAN1_RX (bidir), CAN1_STBN (bidir), CAN1_TX (bidir), CAN2_RX (bidir), CAN2_STBN (bidir), CAN2_TX (bidir)

### Nets
+3.3V_D: C32.2
+5: C30.2 C31.2 U6_A.3(VCC) U6_B.3(VCC)
+7s: J6.3 J6.4 J6.5 J8.3 J8.4 J8.5
GND: C21.1 C30.1 C31.1 C32.1 C33.1 D1.3(K) D2.3(K) J6.6 J6.7 J6.8 J6.9 J8.6 J8.7 J8.8 J8.9 R44.2 R45.2 U6_A.2(GND) U6_B.2(GND)
CAN1_N: D1.2(K) J8.1 R26.2 U6_A.6(CANL)
CAN1_P: D1.1(K) J8.2 R27.1 U6_A.7(CANH)
CAN1_RX: P11.2 U6_A.4(RXD) ; port CAN1_RX
CAN1_STBN: U6_A.5(*SHDN) ; port CAN1_STBN
CAN1_TX: P11.1 U6_A.1(TXD) ; port CAN1_TX
CAN2_N: D2.2(K) J6.1 R10.2 U6_B.6(CANL)
CAN2_P: D2.1(K) J6.2 R11.1 U6_B.7(CANH)
CAN2_RX: P12.2 U6_B.4(RXD) ; port CAN2_RX
CAN2_STBN: U6_B.5(*SHDN) ; port CAN2_STBN
CAN2_TX: P12.1 U6_B.1(TXD) ; port CAN2_TX
NetC21_2: C21.2 R10.1 R11.2
NetC33_2: C33.2 R26.1 R27.2
NetR44_1: R44.1 U6_A.8(RS)
NetR45_1: R45.1 U6_B.8(RS)

### Layout directives
differential pair: CAN1_N, CAN1_P, CAN2_N, CAN2_P

### Library data of the parts
C21 C33 = CMP-03020-003188-1: C0603 4,700 pF X7R 30ppm/°C 10.00% 50 V; Manufacturer: KEMET; Automotive Grade: Grade 1; Voltage Rating: 50 V; Material: Ceramic; Tolerance: 0.1; Capacitance: 4,700 pF; Manufacturer Part Number: C0603C472K5RAC7411; ComponentLink2URL: https://api.kemet.com/component-edge/download/datasheet/C0603C100J5GACAUTO.pdf; Value: 4,700 pF; RoHS: TRUE; Automotive: Yes; Package: C0603C-CF; Device Class L1: Passive Components; Temperature Coefficient: 30ppm/°C; Octopart: https://octopart.com/c0603c472k5rac7411-kemet-3746251; Temperature Range Low: -55°C; Height: 0.87mm; Device Class L2: Capacitors; Lead Free: Yes; ComponentLink2Description: Datasheet; Temperature: -55°C to +125°C; Temperature Range High: +125°C; Temperature Characteristic: X7R; Device Class L3: Ceramic Capacitors; Category: Cap
C30-C32 = CMP-2006-02595-1: Manufacturer: Murata; Part Number: GRM1885C1H101JA01D
D1 D2 = CMP-1063-00164-1: Dual Line CAN Bus Protector, 3-Pin SOT-23, Pb-Free, Tape and Reel; Manufacturer: On Semiconductor; IR Max (uA): 0.1; Number of Lines: 2; Direction: Bidirectional; C Max (pF): 30; PPK Max (W): 350; V(BR) Min (V): 26.2; ComponentLink3URL: http://www.onsemi.cn/pub_link/Collateral/318-08.PDF; Mounting Technology: Surface Mount; ComponentLink2Description: Datasheet; PartNumber: NUP2105LT1G; ComponentLink1URL: http://www.onsemi.com/; PackageVersion: Rev. AP, 11/2009; DatasheetVersion: Rev. 5; RoHS: Pb-Free; PackageReference: SOT-23-3-318-08; ComponentLink2URL: http://www.onsemi.cn/pub_link/Collateral/NUP2105L-D.PDF; ComponentLink1Description: Manufacturer URL; PackageDescription: 3-Pin Small Outline Transistor, Body 2.92 x 1.3 mm, Pitch 0.95 mm; Packing: Tape and Reel; ComponentLink3Description: Package Specification
J6 J8 = CMP-03367-000009-1: CONN D-SUB RCPT 9POS VERT SOLDER; Manufacturer: TE Connectivity; Is Female: yes; Current Rating: 6A; Conn Orientation: Vertical; Conn Gender: Female; Shielding: false; Number Of Contacts: 9; Pitch: 2.74mm; ComponentLink2URL: https://www.te.com/usa-en/product-1-5747150-6.html?te_bu=Cor&te_type=other&te_campaign=oct_glo_cor-oct-global-oth-prtnr-fy19-oct-octo-buy-bom_sma-298_2&elqCampaignId=35216; Manufacturer Part Number: 1-5747150-6; Temperature: -55°C to +105°C; Mouser Description: D-Sub Standard Connectors RECP FRNT MTL SHL 9P female screwlocks; Octopart: https://octopart.com/1-5747150-6-te+connectivity-39500344; Category: Conn; Automotive: No; Package: 1-5747150-6; Device Class L3: unset; Contact Material: Gold,Nickel; Lead Free: Yes; Height: 12.54mm; RoHS: TRUE; ComponentLink2Description: Datasheet; Device Class L2: D-Sub Connectors; Device Class L1: Connectors; Digikey Description: CONN D-SUB RCPT 9POS VERT SOLDER; Temperature Range High: +105°C; Temperature Range Low: -55°C
P11 P12 = Header 2: Header, 2-Pin; LatestRevisionDate: 17-Jul-2002; LatestRevisionNote: Re-released for DXP Platform.; Publisher: Altium Limited
R10 R11 R26 R27 = Res3: RESISTOR, 0603, 60R4 1%, 0.1W; Manufacturer: Panasonic; Manufacturer Part Number: ERJ-3EKF60R4V; Resistance: 60.4R; Power Rating: 100mW; Temperature Coefficient: 100ppm/°C; Voltage Rating: 75V; Voltage Rating (DC): 50V; Published: 8-Jun-2000; LatestRevisionDate: 29-May-2009; LatestRevisionNote: IPC-7351 Footprint Added.; PackageReference: J1-0603; Publisher: Altium Limited; PackageDescription: Chip Resistor; Supplier 1: Digi-Key; Supplier Part Number 1: P60.4HCT-ND; RoHS: Yes; Category: Chip SMD Resistors; Stock 1: 97677; Pricing 1: 1=0.10000, 10=0.05400, 100=0.02190, 1000=0.00983, 2500=0.00853 (USD); Mount: Surface Mount; Case/Package: 0603; Case Code (Metric): 1608; Case Code (Imperial): 0603; Contact Plating: Tin; Min Operating Temperature: -55°C; Max Operating Temperature: 155°C; Tolerance: 1%; Packaging: Tape and Reel; Composition: Thick Film; Number of Terminations: 2; Package Quantity: 1; Termination: SMD/SMT; Max Power Dissipation: 100mW; Military Standard: Not; Features: Automotive AEC-Q200; Length: 1.6mm; Height: 0.022inch; Width: 0.031inch; Depth: 0.8mm; REACH SVHC: No SVHC; Lead Free: Lead Free; ComponentLink1URL: https://datasheet.ciiva.com/28594/1678782-28594695.pdf?src-supplier=Element14; ComponentLink1Description: https://datasheet.ciiva.com/28594/1678782-28594695.pdf?src-supplier=Element14; ComponentLink2URL: https://datasheet.ciiva.com/30163/aoa0000ce2-30163208.pdf?src-supplier=Onlinecomponents.com; ComponentLink2Description: https://datasheet.ciiva.com/30163/aoa0000ce2-30163208.pdf?src-supplier=Onlinecomponents.com; ComponentLink3URL: https://datasheet.ciiva.com/5951/426256-5951371.pdf?src-supplier=Farnell; ComponentLink3Description: https://datasheet.ciiva.com/5951/426256-5951371.pdf?src-supplier=Farnell; ComponentLink4URL: https://datasheet.ciiva.com/16757/70260748-16757877.pdf?src-supplier=Allied+Electronics; ComponentLink4Description: https://datasheet.ciiva.com/16757/70260748-16757877.pdf?src-supplier=Allied+Electronics; ComponentLink5URL: https://datasheet.ciiva.com/24068/aoa0000ce2-24068761.pdf?src-supplier=Mouser; ComponentLink5Description: https://datasheet.ciiva.com/24068/aoa0000ce2-24068761.pdf?src-supplier=Mouser; ComponentLink6URL: https://datasheet.ciiva.com/16783/70260748-16783402.pdf?src-supplier=Allied+Electronics; ComponentLink6Description: https://datasheet.ciiva.com/16783/70260748-16783402.pdf?src-supplier=Allied+Electronics; ComponentLink7URL: https://datasheet.ciiva.com/28677/1678782-28677676.pdf?src-supplier=Element14; ComponentLink7Description: https://datasheet.ciiva.com/28677/1678782-28677676.pdf?src-supplier=Element14; ComponentLink8URL: https://datasheet.ciiva.com/43460/426256-43460428.pdf?src-supplier=Farnell; ComponentLink8Description: https://datasheet.ciiva.com/43460/426256-43460428.pdf?src-supplier=Farnell; ComponentLink9URL: https://datasheet.ciiva.com/46377/426256-46377437.pdf?src-supplier=Element14; ComponentLink9Description: https://datasheet.ciiva.com/46377/426256-46377437.pdf?src-supplier=Element14
R44 R45 = CMP-2001-04896-1: Manufacturer: Vishay Dale; Part Number: CRCW08050000Z0EA
U6_A U6_B = max3057asa+T: No Description Available; Mfr_Name: Maxim Integrated Products; Copyright: Copyright (C) 2022 Ultra Librarian. All rights reserved.; Manufacturer_Part_Number: max3057asa+T; Digi-Key_Part_Number_1: MAX3057ASA+CT-ND; Digi-Key_Part_Number_2: MAX3057ASA+DKR-ND; Digi-Key_Part_Number_3: MAX3057ASA+T-ND; Digi-Key_Part_Number_4: MAX3057ASA+TR-ND; RefDes: RefDes; Type: DEV

## Sheet isoSPI_to_SPI.SchDoc
size A4
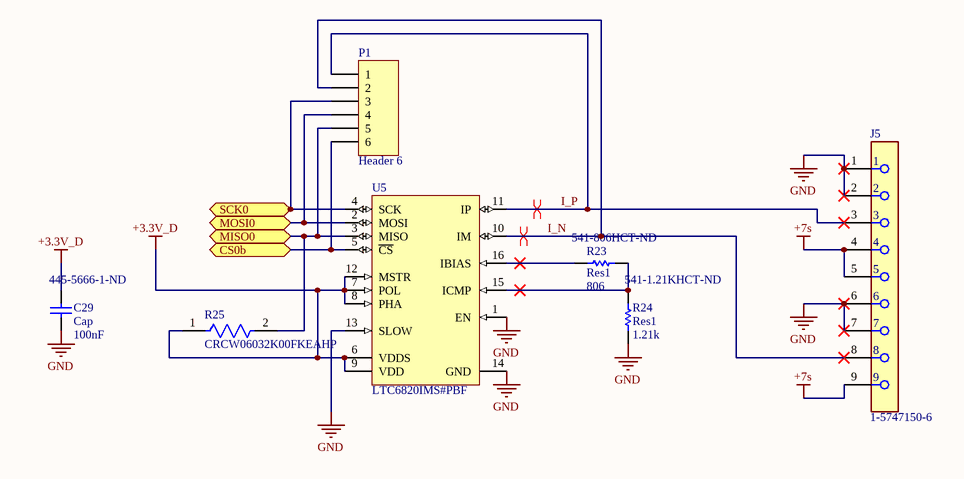
[diagram p3: isoSPI_to_SPI.SchDoc]

### Parts
C29  Cap  value 100nF  Supplier Part Number 1: 445-5666-1-ND  [J1-0603]
J5  1-5747150-6  [FP-1-5747150-6-MFG]
P1  Header 6  [HDR1X6]
R23  Res1  value 806  Supplier Part Number 1: 541-806HCT-ND  [J1-0603]
R24  Res1  value 1.21k  Supplier Part Number 1: 541-1.21KHCT-ND  [J1-0603]
R25  CRCW06032K00FKEAHP  [FP-CRCW0603-HPe3-IPC_C]
U5  LTC6820IMS#PBF  [LT-MS-16_M]

### Ports
CS0b (bidir), MISO0 (bidir), MOSI0 (bidir), SCK0 (bidir)

### Nets
+3.3V_D: C29.2 R25.1 U5.6(VDDS) U5.7(POL) U5.8(PHA) U5.9(VDD) U5.12(MSTR)
+7s: J5.4 J5.5 J5.9
GND: C29.1 J5.1 J5.2 J5.6 J5.7 R24.1 U5.1(EN) U5.13(SLOW) U5.14(GND)
CS0b: P1.6 U5.5(~{CS}) ; port CS0b
I_N: J5.8 P1.2 U5.10(IM)
I_P: J5.3 P1.1 U5.11(IP)
MISO0: P1.5 R25.2 U5.3(MISO) ; port MISO0
MOSI0: P1.4 U5.2(MOSI) ; port MOSI0
SCK0: P1.3 U5.4(SCK) ; port SCK0
NetR23_1: R23.1 U5.16(IBIAS)
NetR23_2: R23.2 R24.2 U5.15(ICMP)

### Layout directives
differential pair: I_N, I_P

### Library data of the parts
C29 = Cap: TDK - CGA3E2X7R1H104K080AA. - CERAMIC CAPACITOR, 0.1UF, 50V, X7R, 0603, FULL REEL; Tolerance: 10%; Published: 8-Jun-2000; LatestRevisionDate: 17-Jul-2002; LatestRevisionNote: Re-released for DXP Platform.; PackageReference: RAD-0.3; Publisher: Altium Limited; PackageDescription: Radial Cap, Thru-Hole; 2 Leads; 0.3 in Pin Spacing; Supplier 1: Digi-Key; Manufacturer: TDK; Manufacturer Part Number: CGA3E2X7R1H104K080AA; RoHS: Yes; Category: Ceramic Capacitors; Stock 1: 7293536; Pricing 1: 1=0.10000, 10=0.07600, 50=0.04160, 100=0.03400, 500=0.02426, 1000=0.01906 (USD); Mount: Surface Mount; Case/Package: 0603; Weight: 7.1E-05oz; Case Code (Imperial): 0603; Case Code (Metric): 1608; Min Operating Temperature: -55°C; Max Operating Temperature: 125°C; Capacitance: 100nF; Packaging: Tape and Reel; Package Quantity: 1; Voltage Rating: 50V; Dielectric: X7R; Voltage Rating (DC): 50V; Termination: SMD/SMT; Voltage: 50V; Composition: Ceramic; Length: 1.6mm; Height: 0.8mm; Width: 0.8mm; Depth: 0.8mm; Thickness: 0.035inch; Ratings: AEC-Q200; Radiation Hardening: No; REACH SVHC: No SVHC; Lead Free: Lead Free; ComponentLink1URL: https://datasheet.ciiva.com/24216/cga3e2x7r1h104k080aa-266291-24216208.pdf?src-supplier=Mouser; ComponentLink1Description: https://datasheet.ciiva.com/24216/cga3e2x7r1h104k080aa-266291-24216208.pdf?src-supplier=Mouser; ComponentLink2URL: https://datasheet.ciiva.com/15192/getdatasheetpartid-715867-15192412.pdf?src-supplier=Verical; ComponentLink2Description: https://datasheet.ciiva.com/15192/getdatasheetpartid-715867-15192412.pdf?src-supplier=Verical; ComponentLink3URL: https://datasheet.ciiva.com/16500/mlccspec-automotive-general-midvoltage-en-16500693.pdf?src-supplier=Future+Electronics; ComponentLink3Description: https://datasheet.ciiva.com/16500/mlccspec-automotive-general-midvoltage-en-16500693.pdf?src-supplier=Future+Electronics; ComponentLink4URL: https://datasheet.ciiva.com/22725/1735392-22725642.pdf?src-supplier=Element14; ComponentLink4Description: https://datasheet.ciiva.com/22725/1735392-22725642.pdf?src-supplier=Element14; ComponentLink5URL: https://datasheet.ciiva.com/23803/1936565-23803084.pdf?src-supplier=Newark; ComponentLink5Description: https://datasheet.ciiva.com/23803/1936565-23803084.pdf?src-supplier=Newark; ComponentLink6URL: https://datasheet.ciiva.com/46385/1735392-46385708.pdf?src-supplier=Element14; ComponentLink6Description: https://datasheet.ciiva.com/46385/1735392-46385708.pdf?src-supplier=Element14
J5 = CMP-03367-000009-1: as J6 on sheet CANbus; ComponentLink2URL: https://www.te.com/usa-en/product-1-5747150-6.html?te_bu=Cor&te_type=other&te_campaign=oct_glo_cor-oct-global-oth-prtnr-fy19-oct-octo-buy-bom_sma-298_2&elqCampaignId=35216; Manufacturer Part Number: 1-5747150-6; Temperature: -55°C to +105°C; Mouser Description: D-Sub Standard Connectors RECP FRNT MTL SHL 9P female screwlocks; Octopart: https://octopart.com/1-5747150-6-te+connectivity-39500344; Category: Conn; Automotive: No; Package: 1-5747150-6; Device Class L3: unset; Contact Material: Gold,Nickel; Lead Free: Yes; Height: 12.54mm; RoHS: TRUE; ComponentLink2Description: Datasheet; Device Class L2: D-Sub Connectors; Device Class L1: Connectors; Digikey Description: CONN D-SUB RCPT 9POS VERT SOLDER; Temperature Range High: +105°C; Temperature Range Low: -55°C
P1 = Header 6: Header, 6-Pin; LatestRevisionDate: 17-Jul-2002; LatestRevisionNote: Re-released for DXP Platform.; Publisher: Altium Limited
R23 = Res1: RES SMD 806 OHM 1% 1/10W 0603; Manufacturer: Vishay; Manufacturer Part Number: CRCW0603806RFKEA; Resistance: 806R; Temperature Coefficient: 100ppm/°C; Power Rating: 100mW; Voltage Rating: 75V; Published: 8-Jun-2000; LatestRevisionDate: 17-Jul-2002; LatestRevisionNote: Re-released for DXP Platform.; PackageReference: AXIAL-0.3; Publisher: Altium Limited; PackageDescription: Axial Device, Thru-Hole; 2 Leads; 0.3 in Pin Spacing; Supplier 1: Digi-Key; RoHS: Yes; Category: Chip SMD Resistors; Stock 1: 15321; Pricing 1: 1=0.10000, 10=0.03300, 100=0.01340, 1000=0.00602, 2500=0.00522 (USD); Mount: Surface Mount; Case/Package: 0603; Weight: 7.1E-05oz; Case Code (Metric): 1608; Case Code (Imperial): 0603; Contact Plating: Tin; Min Operating Temperature: -55°C; Max Operating Temperature: 155°C; Packaging: Tape and Reel; Tolerance: 1%; Package Quantity: 10; Termination: SMD/SMT; Composition: Thick Film; Number of Terminations: 2; Max Power Dissipation: 100mW; Military Standard: Not; Features: Automotive AEC-Q200; Working Voltage: 75V; Length: 1.55mm; Height: 0.45mm; Width: 0.033inch; Depth: 0.85mm; Radiation Hardening: No; REACH SVHC: Unknown; ComponentLink1URL: https://datasheet.ciiva.com/11809/0900766b80d98afc-11809816.pdf?src-supplier=RSComponents; ComponentLink1Description: https://datasheet.ciiva.com/11809/0900766b80d98afc-11809816.pdf?src-supplier=RSComponents; ComponentLink2URL: https://datasheet.ciiva.com/2466/dcrcwe3-2466496.pdf?src-supplier=Digi-Key; ComponentLink2Description: https://datasheet.ciiva.com/2466/dcrcwe3-2466496.pdf?src-supplier=Digi-Key; ComponentLink3URL: https://datasheet.ciiva.com/15159/getdatasheetpartid-32773-15159334.pdf?src-supplier=Verical; ComponentLink3Description: https://datasheet.ciiva.com/15159/getdatasheetpartid-32773-15159334.pdf?src-supplier=Verical; ComponentLink4URL: https://datasheet.ciiva.com/7672/1697337-7672567.pdf?src-supplier=Element14; ComponentLink4Description: https://datasheet.ciiva.com/7672/1697337-7672567.pdf?src-supplier=Element14; ComponentLink5URL: https://datasheet.ciiva.com/16199/dcrcwe3-16199879.pdf?src-supplier=Future+Electronics; ComponentLink5Description: https://datasheet.ciiva.com/16199/dcrcwe3-16199879.pdf?src-supplier=Future+Electronics; ComponentLink6URL: https://datasheet.ciiva.com/3257/dcrcwe3-3257912.pdf?src-supplier=Avnet; ComponentLink6Description: https://datasheet.ciiva.com/3257/dcrcwe3-3257912.pdf?src-supplier=Avnet; ComponentLink7URL: https://datasheet.ciiva.com/7672/1697337-7672568.pdf?src-supplier=Element14; ComponentLink7Description: https://datasheet.ciiva.com/7672/1697337-7672568.pdf?src-supplier=Element14; ComponentLink8URL: https://datasheet.ciiva.com/3257/dcrcwe3-3257913.pdf?src-supplier=Avnet; ComponentLink8Description: https://datasheet.ciiva.com/3257/dcrcwe3-3257913.pdf?src-supplier=Avnet; ComponentLink9URL: https://datasheet.ciiva.com/16782/70201119-16782811.pdf?src-supplier=Allied+Electronics; ComponentLink9Description: https://datasheet.ciiva.com/16782/70201119-16782811.pdf?src-supplier=Allied+Electronics; ComponentLink10URL: https://datasheet.ciiva.com/16884/dcrcwe3-16884269.pdf?src-supplier=Avnet+Europe; ComponentLink10Description: https://datasheet.ciiva.com/16884/dcrcwe3-16884269.pdf?src-supplier=Avnet+Europe; ComponentLink11URL: https://datasheet.ciiva.com/2466/dcrcwe3-2466494.pdf?src-supplier=Digi-Key; ComponentLink11Description: https://datasheet.ciiva.com/2466/dcrcwe3-2466494.pdf?src-supplier=Digi-Key; ComponentLink12URL: https://datasheet.ciiva.com/5546/dcrcwe3-109170-5546782.pdf?src-supplier=Mouser; ComponentLink12Description: https://datasheet.ciiva.com/5546/dcrcwe3-109170-5546782.pdf?src-supplier=Mouser; ComponentLink13URL: https://datasheet.ciiva.com/2466/dcrcwe3-2466495.pdf?src-supplier=Digi-Key; ComponentLink13Description: https://datasheet.ciiva.com/2466/dcrcwe3-2466495.pdf?src-supplier=Digi-Key
R24 = Res1: Res Thick Film 0603 1.21K Ohm 1% 1/10W 100ppm/C Molded SMD Paper T/R; Manufacturer: Vishay; Manufacturer Part Number: CRCW06031K21FKEA; Power Rating: 100mW; Resistance: 1.21kR; Temperature Coefficient: 100ppm/°C; Voltage Rating: 75V; Published: 8-Jun-2000; LatestRevisionDate: 17-Jul-2002; LatestRevisionNote: Re-released for DXP Platform.; PackageReference: AXIAL-0.3; Publisher: Altium Limited; PackageDescription: Axial Device, Thru-Hole; 2 Leads; 0.3 in Pin Spacing; Supplier 1: Digi-Key; RoHS: Yes; Category: Chip SMD Resistors; Stock 1: 10304; Pricing 1: 1=0.10000, 10=0.03300, 100=0.01340, 1000=0.00602, 2500=0.00522 (USD); Mount: Surface Mount; Case/Package: 0603; Weight: 7.1E-05oz; Case Code (Metric): 1608; Case Code (Imperial): 0603; Contact Plating: Tin; Min Operating Temperature: -55°C; Max Operating Temperature: 155°C; Tolerance: 1%; Packaging: Tape and Reel; Composition: Thick Film; Voltage Rating (DC): 75V; Package Quantity: 10; Number of Terminations: 2; Military Standard: Not; Max Power Dissipation: 100mW; Termination: SMD/SMT; Features: Automotive AEC-Q200; Length: 1.55mm; Height: 0.45mm; Width: 0.033inch; Depth: 0.85mm; Radiation Hardening: No; REACH SVHC: Unknown; Lead Free: Lead Free; ComponentLink1URL: https://datasheet.ciiva.com/11811/0900766b80d98afc-11811488.pdf?src-supplier=RSComponents; ComponentLink1Description: https://datasheet.ciiva.com/11811/0900766b80d98afc-11811488.pdf?src-supplier=RSComponents; ComponentLink2URL: https://datasheet.ciiva.com/2466/dcrcwe3-2466209.pdf?src-supplier=Digi-Key; ComponentLink2Description: https://datasheet.ciiva.com/2466/dcrcwe3-2466209.pdf?src-supplier=Digi-Key; ComponentLink3URL: https://datasheet.ciiva.com/2466/dcrcwe3-2466210.pdf?src-supplier=Digi-Key; ComponentLink3Description: https://datasheet.ciiva.com/2466/dcrcwe3-2466210.pdf?src-supplier=Digi-Key; ComponentLink4URL: https://datasheet.ciiva.com/2466/dcrcwe3-2466211.pdf?src-supplier=Digi-Key; ComponentLink4Description: https://datasheet.ciiva.com/2466/dcrcwe3-2466211.pdf?src-supplier=Digi-Key; ComponentLink5URL: https://datasheet.ciiva.com/3257/dcrcwe3-3257157.pdf?src-supplier=Avnet; ComponentLink5Description: https://datasheet.ciiva.com/3257/dcrcwe3-3257157.pdf?src-supplier=Avnet; ComponentLink6URL: https://datasheet.ciiva.com/7690/1533075-7690856.pdf?src-supplier=Element14; ComponentLink6Description: https://datasheet.ciiva.com/7690/1533075-7690856.pdf?src-supplier=Element14; ComponentLink7URL: https://datasheet.ciiva.com/16213/dcrcwe3-16213112.pdf?src-supplier=Future+Electronics; ComponentLink7Description: https://datasheet.ciiva.com/16213/dcrcwe3-16213112.pdf?src-supplier=Future+Electronics; ComponentLink8URL: https://datasheet.ciiva.com/5541/dcrcwe3-109170-5541610.pdf?src-supplier=Mouser; ComponentLink8Description: https://datasheet.ciiva.com/5541/dcrcwe3-109170-5541610.pdf?src-supplier=Mouser; ComponentLink9URL: https://datasheet.ciiva.com/16764/70201119-16764972.pdf?src-supplier=Allied+Electronics; ComponentLink9Description: https://datasheet.ciiva.com/16764/70201119-16764972.pdf?src-supplier=Allied+Electronics
R25 = CMP-2000-03160-2: RES Thick Film, 2kΩ, 1%, 0.33W, 100ppm/°C, 0603; Max Power Dissipation: 250mW; Voltage Rating: 75V; Resistance: 2kR; Radiation Hardening: No; Min Operating Temperature: -55°C; Features: Automotive AEC-Q200; Tolerance: 1%; Width: 0.033inch; Military Standard: Not; Weight: 7.1E-05oz; Lead Free: Lead Free; Length: 1.6mm; Package Quantity: 10; Composition: Thick Film; Mount: Surface Mount; Depth: 0.85mm; Case Code (Metric): 1608; Case Code (Imperial): 0603; Max Operating Temperature: 155°C; Power Rating: 250mW; Termination: Solder; Height: 0.45mm; Temperature Coefficient: 100ppm/°C; Packaging: Tape and Reel; Case/Package: 0603; Contact Plating: Tin; Number of Terminations: 2
U5 = CMP-0937-00012-1: IsoSPI Isolated Communication Interface, 2.7 to 5.5 V, -40 to 85 degC, 16-Pin MSOP (MS), Pb-Free; Manufacturer: Linear Technology; Receiver Input Resistance: 35 kOhm; IO Supply Current: 1 uA Max.; Supply Current, IDLE State: 2 uA; IO Supply Voltage Range: 1.7 to 5.5 V; VBIAS: 1.9 to 2.1 V; ComponentLink3Description: Package Specification; PackageDescription: 16-Pin Micro Small Outline Package, Body 4.039 x 3 mm, Pitch 0.5 mm; PackageVersion: Rev. A; Temperature Range (degC): -40 to 85; PackageReference: MS-16; DatasheetVersion: Rev. A; ComponentLink2URL: http://cds.linear.com/docs/en/datasheet/6820fa.pdf; Power Supply: 2.7 to 5.5 V; Mounting Technology: Surface Mount; ComponentLink1URL: http://www.linear.com/; ComponentLink3URL: http://cds.linear.com/docs/en/packaging/05081669_A_MS16.pdf; PartNumber: LTC6820IMS#PBF; ComponentLink2Description: Datasheet; ComponentLink1Description: Manufacturer URL